# Altium schematic sheet sch.SchDoc
size A4; SheetNumber: 1; SheetTotal: 1
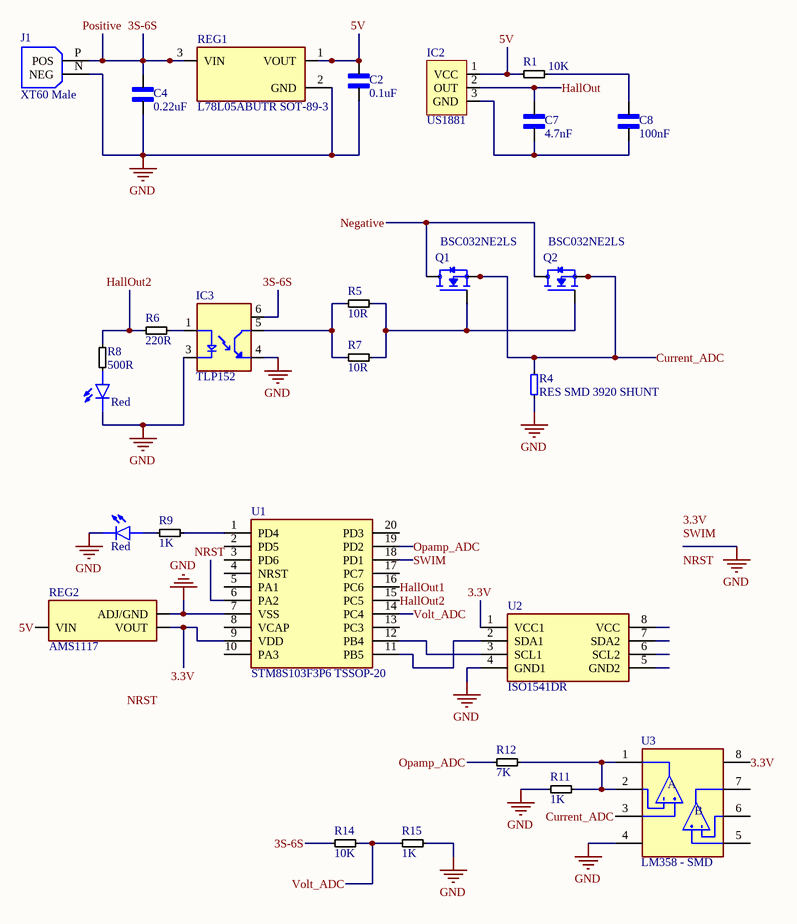
[diagram p0: sch.SchDoc]

## Parts
C2  0.1uF  [0805 SMD CAP]
C4  0.22uF  [0805 SMD CAP]
C7  4.7nF  [0805 SMD CAP]
C8  100nF  [0805 SMD CAP]
D2  Red  [0805 SMD LED]
D3  Red  [0805 SMD LED]
IC2  US1881  [UA]
IC3  TLP152  [SOIC-6]
J1  XT60 Male  [XT60 Male Pin]
Q1  BSC032NE2LS  [TDSON-8]
Q2  BSC032NE2LS  [TDSON-8]
R1  10K  [0805 SMD RES]
R4  RES SMD 3920 SHUNT  [RES 3920 SMD]
R5  10R  [0805 SMD RES]
R6  220R  [0805 SMD RES]
R7  10R  [0805 SMD RES]
R8  500R  [0805 SMD RES]
R9  1K  [0805 SMD RES]
R11  1K  [0805 SMD RES]
R12  7K  [0805 SMD RES]
R14  10K  [0805 SMD RES]
R15  1K  [0805 SMD RES]
REG1  L78L05ABUTR SOT-89-3  [SOT89-3]
REG2  AMS1117  [SOT-223]
U1  STM8S103F3P6 TSSOP-20  [TSSOP-20]
U2  ISO1541DR  [SOIC-8]
U3  LM358 - SMD  [SOIC-8]

## Nets
GND: C2.2 C4.2 D2.C D3.C IC3.3(C) IC3.4(GND) J1.N(NEG) R4.1 R11.1 R15.2 REG1.2(GND) REG2.1(ADJ/GND) U1.7(VSS) U2.4(GND1) U3.4(V-)
3.3V: REG2.2(VOUT) U1.9(VDD) U2.1(VCC1) U3.8(V+)
3S-6S: C4.1 IC3.6(Vcc) J1.P(POS) R14.1 REG1.3(VIN)  [also labelled Positive]
5V: C2.1 IC2.1(VCC) R1.1 REG1.1(VOUT) REG2.3(VIN)
Current_ADC: Q1.1(S) Q1.2(S) Q1.3(S) Q2.1(S) Q2.2(S) Q2.3(S) R4.2 U3.3(IN1+)
HallOut: C7.1 IC2.2(OUT)
HallOut1: U1.16(PC6)
HallOut2: R6.1 R8.2 U1.15(PC5)
Negative: Q1.5(D) Q2.5(D)
NRST: U1.6(PA2)
Opamp_ADC: R12.1 U1.19(PD2)
SWIM: U1.18(PD1)
Volt_ADC: R14.2 R15.1 U1.14(PC4)
NetC7_2: C7.2 C8.2 IC2.3(GND)
NetC8_1: C8.1 R1.2
NetD2_A: D2.A R8.1
NetD3_A: D3.A R9.2
NetIC3_1: IC3.1(A) R6.2
NetIC3_5: IC3.5(Vo) R5.1 R7.1
NetQ1_4: Q1.4(G) Q2.4(G) R5.2 R7.2
NetR9_1: R9.1 U1.1(PD4)
NetR11_2: R11.2 R12.2 U3.1(OUT1) U3.2(IN1-)
NetU1_11: U1.11(PB5) U2.2(SDA1)
NetU1_12: U1.12(PB4) U2.3(SCL1)

Not connected (* = marked no-connect by the designer): U1 2(PD5) 3(PD6) 4(NRST) 5(PA1) 8(VCAP) 10(PA3) 13(PC3) 17(PC7) 20(PD3); U2 5(GND2) 6(SCL2) 7(SDA2) 8(VCC); U3 5(IN2+) 6(IN2-) 7(OUT2)

## Notes on the sheet
- Labels drawn without touching a wire or pin: 3.3V, NRST, SWIM
- (in symbol LM358 - SMD) A; B

## Library data of the parts
C2 C4 C7 C8 = CAP SMD 0805
D2 D3 = LED 0805 SMD
IC3 = TLP152-SMD
J1 = XT60 Male Pin
Q1 Q2 = TDSON-8 MOSFET
R1 R5-R9 R11 R12 R14 R15 = RES SMD 0805
REG1 = L78L05ABUTR
U1 = STM8S103F3P6